# Altium schematic sheet 2003A.SchDoc
size A4
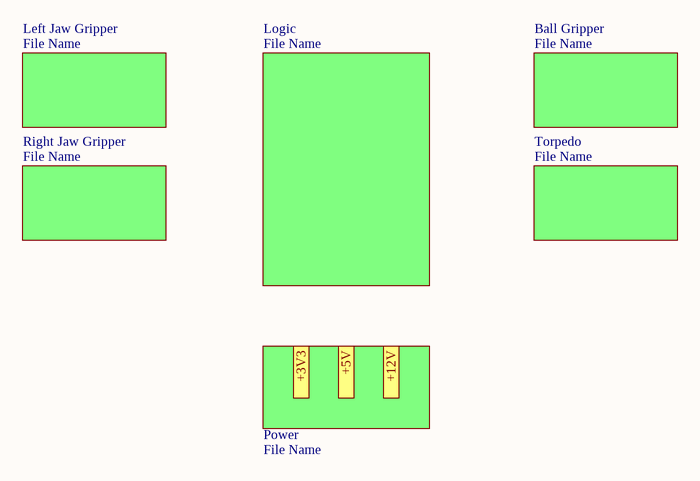
[diagram p0: 2003A.SchDoc]

## Sub-sheets
Ball Gripper = File Name: no entries
Left Jaw Gripper = File Name: no entries
Logic = File Name: no entries
Power = File Name: no entries
Right Jaw Gripper = File Name: no entries
Torpedo = File Name: no entries

## Ports
+3V3, +5V, +12V